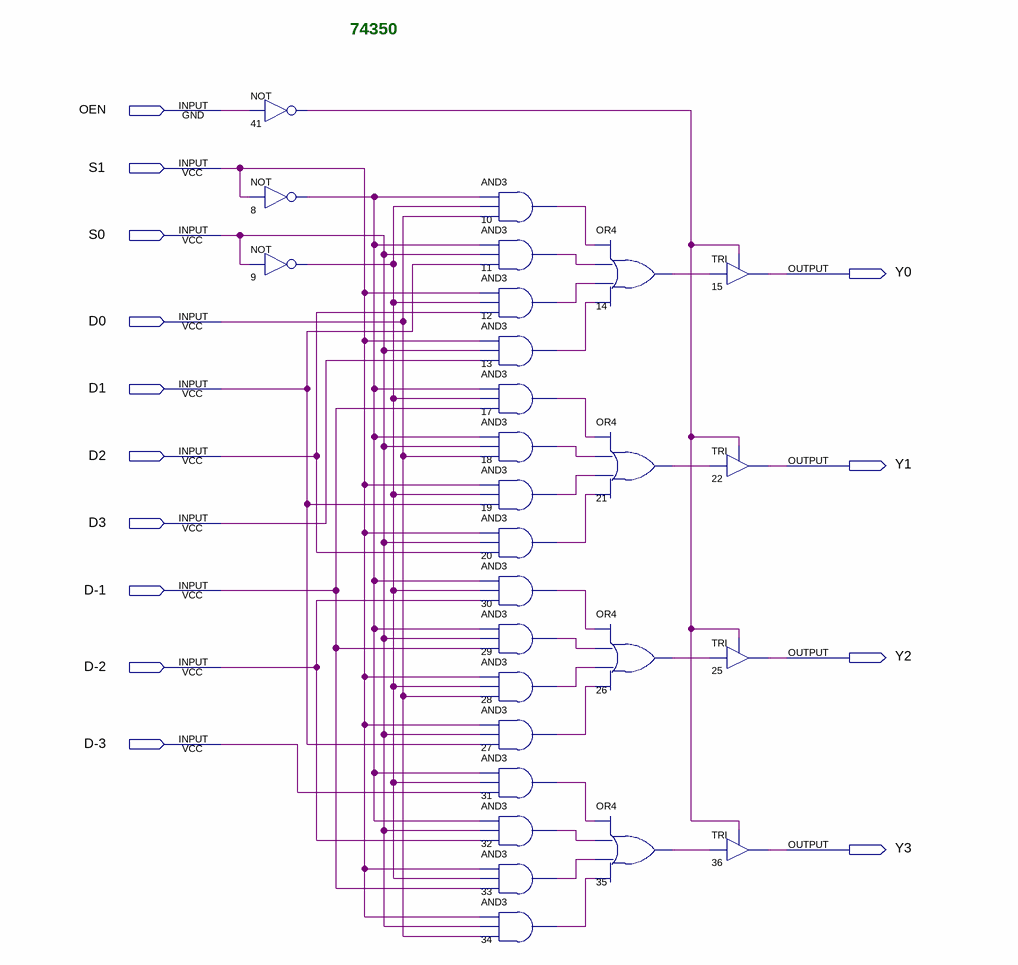
[diagram p0: schematic sheet]
// Quartus schematic 74350.bdf as structural Verilog: 27 symbols, 14 pins
module \74350  (
  input  OEN,
  input  S1,
  input  S0,
  input  D0,
  input  D1,
  input  D2,
  input  D3,
  input  \D-1 ,
  input  \D-2 ,
  input  \D-3 ,
  output Y0,
  output Y1,
  output Y2,
  output Y3
);

  wire n8_out, n9_out, n10_out, n11_out, n12_out, n13_out, n14_out, n17_out, n18_out, n19_out, n20_out,
       n21_out, n26_out, n27_out, n28_out, n29_out, n30_out, n31_out, n32_out, n33_out, n34_out, n35_out,
       n41_out;

  not u_41 (n41_out, OEN);
  not u_8 (n8_out, S1);
  not u_9 (n9_out, S0);
  and u_10 (n10_out, n8_out, n9_out, D0);
  and u_11 (n11_out, n8_out, S0, D1);
  and u_12 (n12_out, S1, n9_out, D2);
  and u_13 (n13_out, S1, S0, D3);
  and u_17 (n17_out, n8_out, n9_out, \D-1 );
  and u_18 (n18_out, n8_out, S0, D0);
  and u_19 (n19_out, S1, n9_out, D1);
  and u_20 (n20_out, S1, S0, D2);
  and u_30 (n30_out, n8_out, n9_out, \D-2 );
  and u_29 (n29_out, n8_out, S0, \D-1 );
  and u_28 (n28_out, S1, n9_out, D0);
  and u_27 (n27_out, S1, S0, D1);
  and u_31 (n31_out, n8_out, n9_out, \D-3 );
  and u_32 (n32_out, n8_out, S0, \D-2 );
  and u_33 (n33_out, S1, n9_out, \D-1 );
  and u_34 (n34_out, S1, S0, D0);
  or u_14 (n14_out, n10_out, n11_out, n12_out, n13_out);
  or u_21 (n21_out, n17_out, n18_out, n19_out, n20_out);
  or u_26 (n26_out, n30_out, n29_out, n28_out, n27_out);
  or u_35 (n35_out, n31_out, n32_out, n33_out, n34_out);
  TRI u_15 (.IN(n14_out), .OE(n41_out), .OUT(Y0));
  TRI u_22 (.IN(n21_out), .OE(n41_out), .OUT(Y1));
  TRI u_25 (.IN(n26_out), .OE(n41_out), .OUT(Y2));
  TRI u_36 (.IN(n35_out), .OE(n41_out), .OUT(Y3));

  // Notes on the sheet:
  //   74350
endmodule
